# Altium project riego.PrjPcb
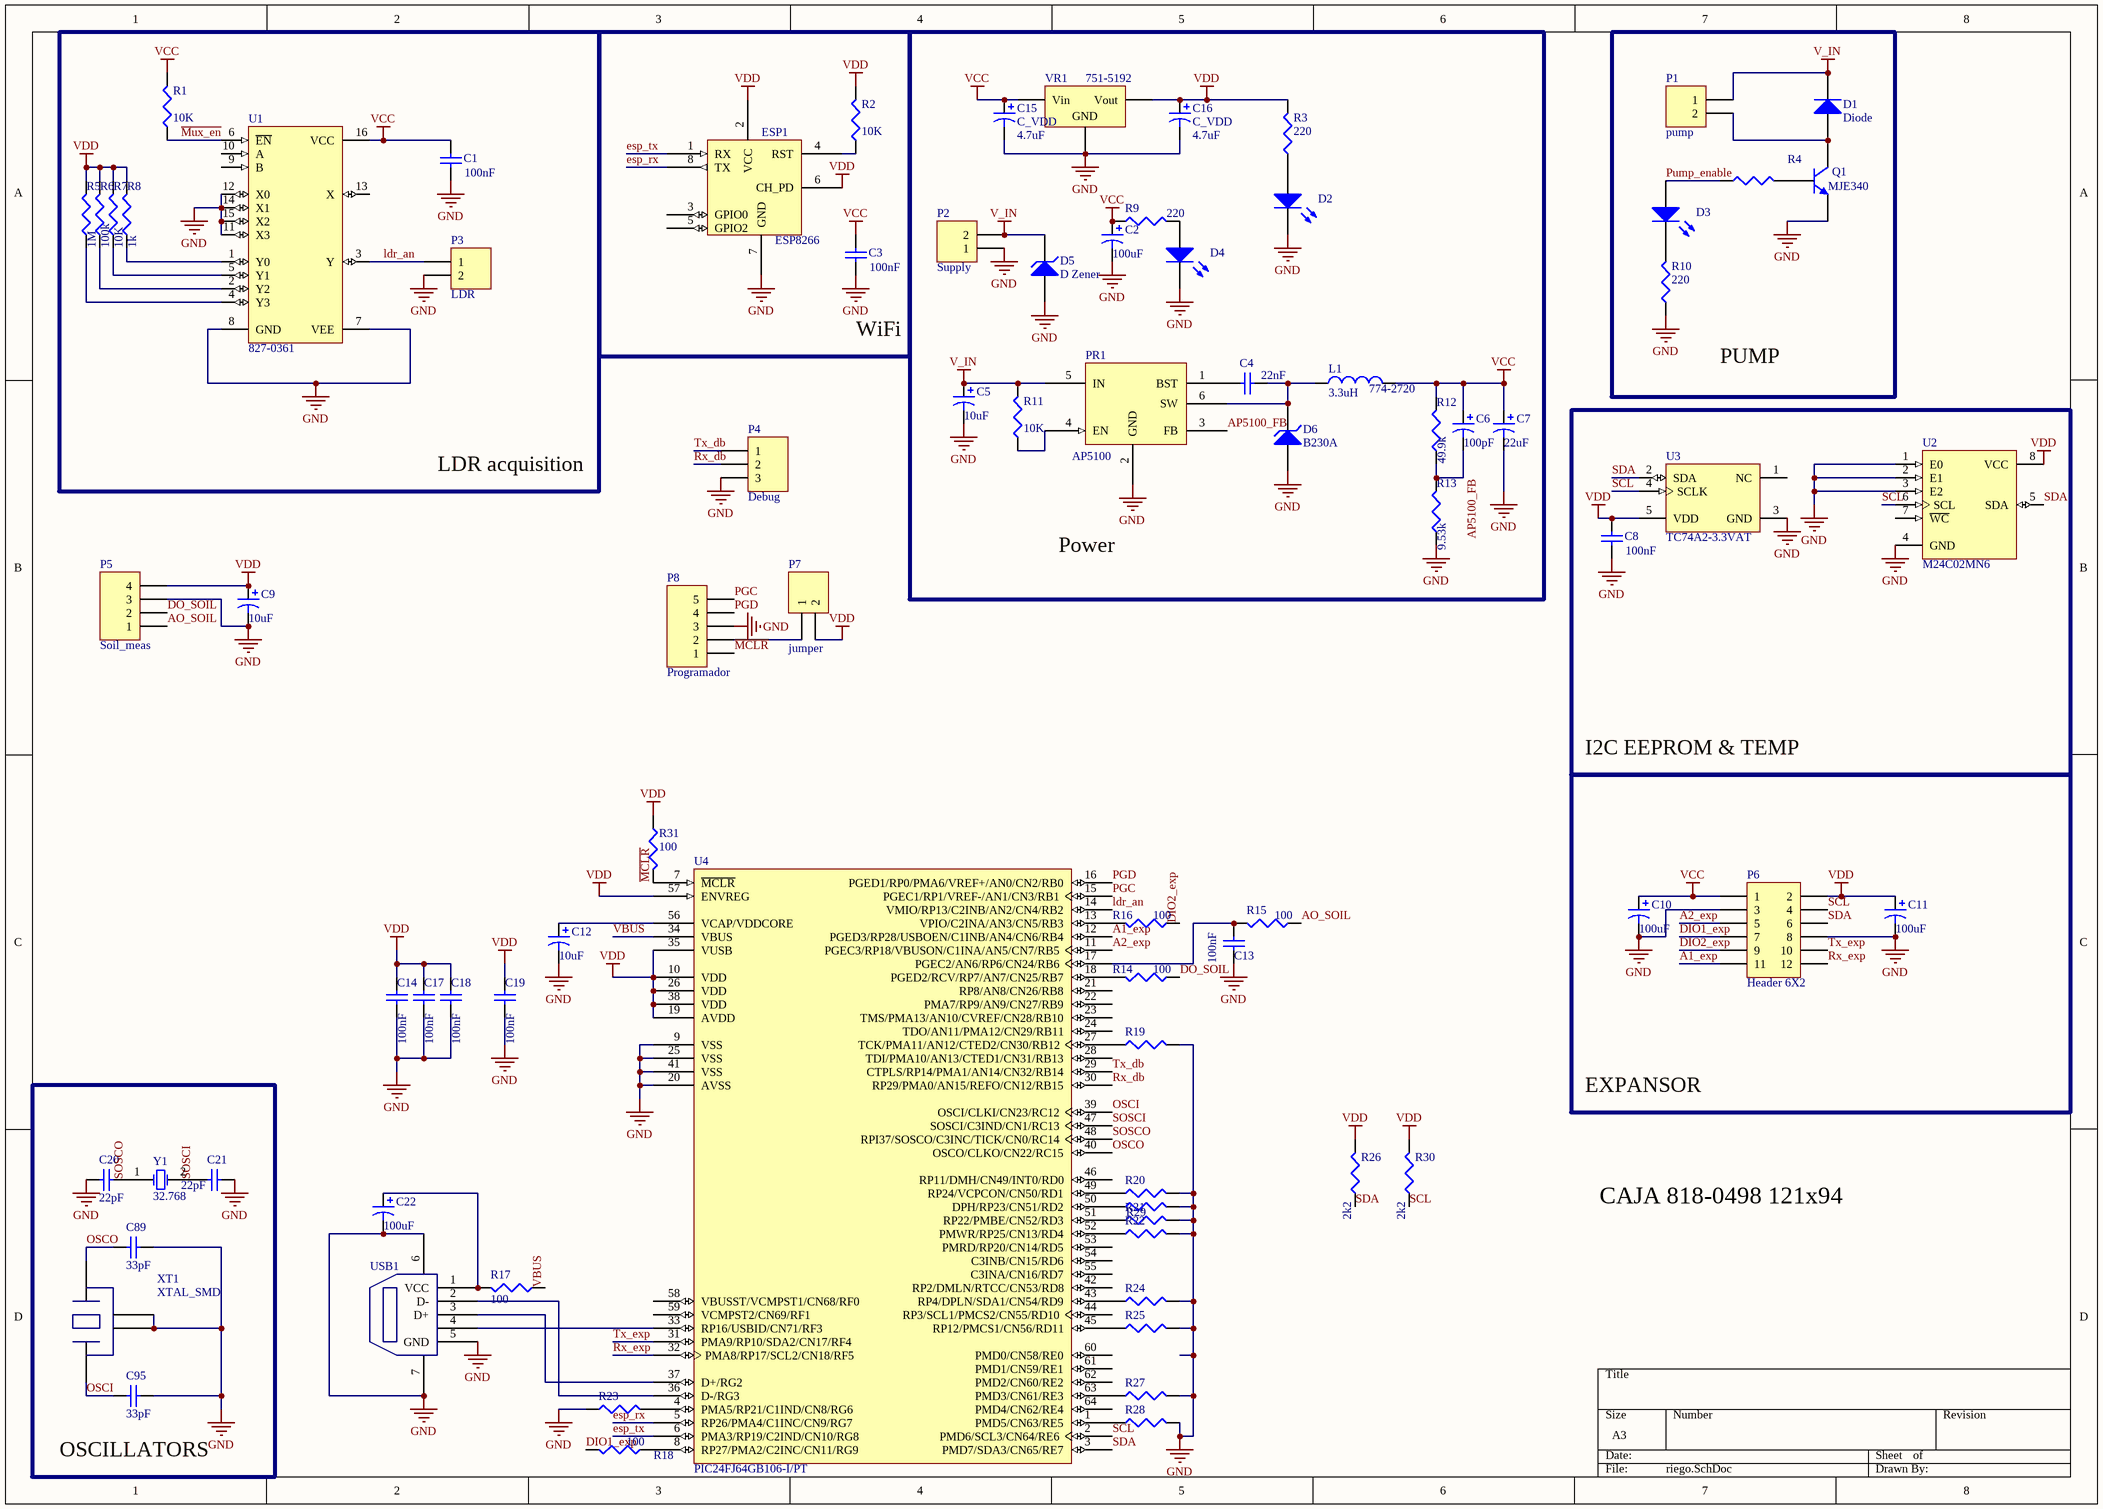
[diagram p0: riego.SchDoc]
1 sheet, 81 parts. Net scope: global (net labels, ports and power ports of the same name join across sheets).
Board file: riego.PcbDoc

## Sheet riego.SchDoc
size A3

### Parts
C1  value 100nF  [CAPC1608L]  (hidden comment: Cap Semi)
C2  value 100uF  [TC3528-1411]
C3  value 100nF  [CAPC1608L]  (hidden comment: Cap Semi)
C4  value 22nF  [CAPC1608L]  (hidden comment: Cap Semi)
C5  value 10uF  [TC3528-1411]
C6  value 100pF  [TC3528-1411]
C7  value 22uF  [TC3528-1411]
C8  value 100nF  [CAPC1608L]  (hidden comment: Cap Semi)
C9  value 10uF  [TC3528-1411]
C10  value 100uF  [TC3528-1411]
C11  value 100uF  [TC3528-1411]
C12  value 10uF  [TC3528-1411]
C13  value 100nF  [CAPC1608L]  (hidden comment: Cap Semi)
C14  value 100nF  [CAPC1608L]  (hidden comment: Cap Semi)
C15  C_VDD  value 4.7uF  [CAPC1608N]
C16  C_VDD  value 4.7uF  [CAPC1608L]
C17  value 100nF  [CAPC1608L]  (hidden comment: Cap Semi)
C18  value 100nF  [CAPC1608L]  (hidden comment: Cap Semi)
C19  value 100nF  [CAPC1608L]  (hidden comment: Cap Semi)
C20  value 22pF  [C1206]  (hidden comment: Cap Semi)
C21  value 22pF  [C1206]  (hidden comment: Cap Semi)
C22  value 100uF  [TC3528-1411]
C89  value 33pF  [C1206]  (hidden comment: Cap Semi)
C95  value 33pF  [C1206]  (hidden comment: Cap Semi)
D1  Diode  [CD4532-1812]
D2  Ledred  [CD1608-0603]  (value not drawn)
D3  Ledred  [CD1608-0603]  (value not drawn)
D4  Ledgreen  [CD1608-0603]  (value not drawn)
D5  D Zener  [CD4532-1812]
D6  B230A  [CD4532-1812]
ESP1  ESP8266  [ESP8266]
L1  774-2720  value 3.3uH  [INDC5750N]
P1  pump  [Headerx2_5.08]
P2  Supply  [JACK_POWER]
P3  LDR  [HDR1X2]
P4  Debug  [HDR1X3]
P5  Soil_meas  [HDR1X4]
P6  Header 6X2  [HEADER_SMD_6x2]
P7  jumper  [HDR1X2]
P8  Programador  [Header_prog]
PR1  AP5100  [SOT26A-6L]
Q1  MJE340  [SOT223-4L]
R1  value 10K  [J1-0603]  (hidden comment: Res3)
R2  value 10K  [J1-0603]  (hidden comment: Res3)
R3  value 220  [J1-0603]  (hidden comment: Res3)
R4  Res3  [J1-0603]  (value not drawn)
R5  value 1M  [J1-0603]  (hidden comment: Res3)
R6  value 100k  [J1-0603]  (hidden comment: Res3)
R7  value 10K  [J1-0603]  (hidden comment: Res3)
R8  value 1k  [J1-0603]  (hidden comment: Res3)
R9  value 220  [J1-0603]  (hidden comment: Res3)
R10  value 220  [J1-0603]  (hidden comment: Res3)
R11  value 10K  [J1-0603]  (hidden comment: Res3)
R12  value 49.9k  [J1-0603]  (hidden comment: Res3)
R13  value 9.53k  [J1-0603]  (hidden comment: Res3)
R14  value 100  [J1-0603]  (hidden comment: Res3)
R15  value 100  [J1-0603]  (hidden comment: Res3)
R16  value 100  [J1-0603]  (hidden comment: Res3)
R17  value 100  [J1-0603]  (hidden comment: Res3)
R18  value 100  [J1-0603]  (hidden comment: Res3)
R19  Res3  [J1-0603]  (value not drawn)
R20  Res3  [J1-0603]  (value not drawn)
R21  Res3  [J1-0603]  (value not drawn)
R22  Res3  [J1-0603]  (value not drawn)
R23  Res3  [J1-0603]  (value not drawn)
R24  Res3  [J1-0603]  (value not drawn)
R25  Res3  [J1-0603]  (value not drawn)
R26  value 2k2  [J1-0603]  (hidden comment: Res3)
R27  Res3  [J1-0603]  (value not drawn)
R28  Res3  [J1-0603]  (value not drawn)
R29  Res3  [J1-0603]  (value not drawn)
R30  value 2k2  [J1-0603]  (hidden comment: Res3)
R31  value 100  [J1-0603]  (hidden comment: Res3)
U1  827-0361  [SO16_L]
U2  M24C02MN6  [SOP8_N]
U3  TC74A2-3.3VAT  [TO-220-AT5]
U4  PIC24FJ64GB106-I/PT  [TQFP-PT64_L]
USB1  Micro_USB  [micro_usb]  (value not drawn)
VR1  751-5192  [DPAK]
XT1  XTAL_SMD  [12SMXB-14SMX]
Y1  32.768  [BCY-W2/D1.5]

### Blocks framed on the sheet
LDR acquisition: C1 P3 R1 R5-R8 U1
WiFi: C3 ESP1 R2
Power: C2 C4-C7 C15 C16 D2 D4-D6 L1 P2 PR1 R3 R9 R11-R13 VR1
PUMP: D1 D3 P1 Q1 R4 R10
I2C EEPROM & TEMP: C8 U2 U3
OSCILLATORS: C20 C21 C89 C95 XT1 Y1

### Nets
GND: C1.1 C2.2 C3.1 C5.2 C7.2 C8.1 C9.2 C10.2 C11.2 C12.2 C13.1 C14.1 C15.2 C16.2 C17.1 C18.1 C19.1 C20.2 C21.1 C22.2 C89.1 C95.1 D2.2(K) D4.2(K) D5.1(A) D6.1(A) ESP1.7(GND) P2.1 P3.2 P4.3 P5.3 P6.3 P6.8 P8.3 PR1.2(GND) Q1.3(E) R10.1 R13.1 R19.2 R20.2 R21.2 R22.2 R23.1 R24.2 R25.2 R27.2 R28.2 R29.2 U1.7(VEE) U1.8(GND) U1.11(X3) U1.12(X0) U1.14(X1) U1.15(X2) U2.1(E0) U2.2(E1) U2.3(E2) U2.4(GND) U3.3(GND) U4.9(VSS) U4.20(AVSS) U4.25(VSS) U4.41(VSS) USB1.5(GND) USB1.6(SH) USB1.7(SH) VR1.2(GND) XT1.2 XT1.4
V_IN: C5.1 D1.2(K) D5.2(K) P1.1 P2.2 PR1.5(IN) R11.2
VCC: C1.2 C2.1 C3.2 C6.1 C7.1 C10.1 C15.1 L1.2 P6.1 R1.2 R9.1 R12.2 U1.16(VCC) VR1.1(Vin)
VDD: C8.2 C9.1 C11.1 C14.2 C16.1 C17.2 C18.2 C19.2 ESP1.2(VCC) ESP1.6(CH_PD) P5.4 P6.2 P7.2 R2.2 R3.2 R5.2 R6.2 R7.2 R8.2 R26.2 R30.2 R31.1 U2.8(VCC) U3.5(VDD) U4.10(VDD) U4.19(AVDD) U4.26(VDD) U4.35(VUSB) U4.38(VDD) U4.57(ENVREG) VR1.3(Vout)
~{MCLR}: P8.1 R31.2 U4.7(~{MCLR})
~{Mux_en}: R1.1 U1.6(~{EN})
A1_exp: P6.11 U4.12(PGED3/RP28/USBOEN/C1INB/AN4/CN6/RB4)
A2_exp: P6.5 U4.11(PGEC3/RP18/VBUSON/C1INA/AN5/CN7/RB5)
AO_SOIL: P5.1 R15.1
AP5100_FB: C6.2 PR1.3(FB) R12.1 R13.2
DIO1_exp: P6.7 R18.2
DIO2_exp: P6.9 R16.1
DO_SOIL: P5.2 R14.1
esp_rx: ESP1.8(TX) U4.5(RP26/PMA4/C1INC/CN9/RG7)
esp_tx: ESP1.1(RX) U4.6(PMA3/RP19/C2IND/CN10/RG8)
ldr_an: P3.1 U1.3(Y) U4.14(VMIO/RP13/C2INB/AN2/CN4/RB2)
OSCI: C95.2 U4.39(OSCI/CLKI/CN23/RC12) XT1.1
OSCO: C89.2 U4.40(OSCO/CLKO/CN22/RC15) XT1.3
PGC: P8.5 U4.15(PGEC1/RP1/VREF-/AN1/CN3/RB1)
PGD: P8.4 U4.16(PGED1/RP0/PMA6/VREF+/AN0/CN2/RB0)
Pump_enable: D3.1(A) R4.1
Rx_db: P4.2 U4.30(RP29/PMA0/AN15/REFO/CN12/RB15)
Rx_exp: P6.12 U4.32(PMA8/RP17/SCL2/CN18/RF5)
SCL: P6.4 R30.1 U2.6(SCL) U3.4(SCLK) U4.2(PMD6/SCL3/CN64/RE6)
SDA: P6.6 R26.1 U2.5(SDA) U3.2(SDA) U4.3(PMD7/SDA3/CN65/RE7)
SOSCI: C21.2 U4.47(SOSCI/C3IND/CN1/RC13) Y1.2(OSC2)
SOSCO: C20.1 U4.48(RPI37/SOSCO/C3INC/TICK/CN0/RC14) Y1.1(OSC1)
Tx_db: P4.1 U4.29(CTPLS/RP14/PMA1/AN14/CN32/RB14)
Tx_exp: P6.10 U4.31(PMA9/RP10/SDA2/CN17/RF4)
VBUS: R17.1 U4.34(VBUS)
NetC4_1: C4.1 D6.2(K) L1.1 PR1.6(SW)
NetC4_2: C4.2 PR1.1(BST)
NetC12_1: C12.1 U4.56(VCAP/VDDCORE)
NetC13_2: C13.2 R15.2 U4.17(PGEC2/AN6/RP6/CN24/RB6)
NetC22_1: C22.1 R17.2 USB1.1(VCC)
NetD1_1: D1.1(A) P1.2 Q1.2(C)
NetD2_1: D2.1(A) R3.1
NetD3_2: D3.2(K) R10.2
NetD4_1: D4.1(A) R9.2
NetESP1_4: ESP1.4(RST) R2.1
NetP7_1: P7.1 P8.2
NetPR1_4: PR1.4(EN) R11.1
NetQ1_1: Q1.1(B) R4.2
NetR5_1: R5.1 U1.4(Y3)
NetR6_1: R6.1 U1.2(Y2)
NetR7_1: R7.1 U1.5(Y1)
NetR8_1: R8.1 U1.1(Y0)
NetR14_2: R14.2 U4.18(PGED2/RCV/RP7/AN7/CN25/RB7)
NetR16_2: R16.2 U4.13(VPIO/C2INA/AN3/CN5/RB3)
NetR18_1: R18.1 U4.8(RP27/PMA2/C2INC/CN11/RG9)
NetR19_1: R19.1 U4.27(TCK/PMA11/AN12/CTED2/CN30/RB12)
NetR20_1: R20.1 U4.49(RP24/VCPCON/CN50/RD1)
NetR21_1: R21.1 U4.51(RP22/PMBE/CN52/RD3)
NetR22_1: R22.1 U4.52(PMWR/RP25/CN13/RD4)
NetR23_2: R23.2 U4.4(PMA5/RP21/C1IND/CN8/RG6)
NetR24_1: R24.1 U4.43(RP4/DPLN/SDA1/CN54/RD9)
NetR25_1: R25.1 U4.45(RP12/PMCS1/CN56/RD11)
NetR27_1: R27.1 U4.63(PMD3/CN61/RE3)
NetR28_1: R28.1 U4.1(PMD5/CN63/RE5)
NetR29_1: R29.1 U4.50(DPH/RP23/CN51/RD2)
NetU4_33: U4.33(RP16/USBID/CN71/RF3) USB1.4
NetU4_36: U4.36(D-/RG3) USB1.2(D-)
NetU4_37: U4.37(D+/RG2) USB1.3(D+)

Not connected (* = marked no-connect by the designer): ESP1 3(GPIO0) 5(GPIO2); U1 9(B) 10(A) 13(X); U2 7(~{WC}); U3 1(NC); U4 21(RP8/AN8/CN26/RB8) 22(PMA7/RP9/AN9/CN27/RB9) 23(TMS/PMA13/AN10/CVREF/CN28/RB10) 24(TDO/AN11/PMA12/CN29/RB11) 28(TDI/PMA10/AN13/CTED1/CN31/RB13) 42(RP2/DMLN/RTCC/CN53/RD8) 44(RP3/SCL1/PMCS2/CN55/RD10) 46(RP11/DMH/CN49/INT0/RD0) 53(PMRD/RP20/CN14/RD5) 54(C3INB/CN15/RD6) 55(C3INA/CN16/RD7) 58(VBUSST/VCMPST1/CN68/RF0) 59(VCMPST2/CN69/RF1) 60(PMD0/CN58/RE0) 61(PMD1/CN59/RE1) 62(PMD2/CN60/RE2) 64(PMD4/CN62/RE4)

### Notes on the sheet
- EXPANSOR
- CAJA 818-0498 121x94

### Library data of the parts
C1 C3 C4 C8 C13 C14 C17-C21 C89 C95 = Cap Semi: Capacitor (Semiconductor SIM Model); Published: 8-Jun-2000; LatestRevisionDate: 17-Jul-2002; LatestRevisionNote: Re-released for DXP Platform.; PackageReference: C1206; Publisher: Altium Limited
C2 C5-C7 C9-C12 C15 C16 C22 = Cap Pol1: Polarized Capacitor (Radial); Published: 8-Jun-2000; LatestRevisionDate: 17-Jul-2002; LatestRevisionNote: Re-released for DXP Platform.; PackageReference: RB7.6-15; Publisher: Altium Limited
D1 = Diode: Default Diode; Published: 8-Jun-2000; LatestRevisionDate: 17-Jul-2002; LatestRevisionNote: Re-released for DXP Platform.; PackageDocument: Sep-1996; PackageReference: SMC; Publisher: Altium Limited; Code_JEDEC: DO-214-AB
D2-D4 = LED3: Typical BLUE SiC LED; Published: 8-Jun-2000; LatestRevisionDate: 17-Dec-2003; LatestRevisionNote: PCB Footprint replaced.; DatasheetDocument: 16-Apr-2002; PackageDocument: 16-Apr-2002; PackageReference: 3.5X2.8X1.9; Publisher: Altium Limited
D5 D6 = D Zener: Zener Diode; Published: 8-Jun-2000; LatestRevisionDate: 17-Jul-2002; LatestRevisionNote: Re-released for DXP Platform.; PackageReference: DIODE-0.7; Publisher: Altium Limited
L1 = Inductor: Code_IEC: 1005; Published: 8-Jun-2000; LatestRevisionDate: 17-Jul-2002; LatestRevisionNote: Re-released for DXP Platform.; PackageReference: 0402-A; Publisher: Altium Limited; Code_JEITA: 0402
P1-P3 P7 = Header 2: Header, 2-Pin; LatestRevisionDate: 17-Jul-2002; LatestRevisionNote: Re-released for DXP Platform.; Publisher: Altium Limited
P4 = Header 3: Header, 3-Pin; LatestRevisionDate: 17-Jul-2002; LatestRevisionNote: Re-released for DXP Platform.; Publisher: Altium Limited
P5 = Header 4: Header, 4-Pin; LatestRevisionDate: 17-Jul-2002; LatestRevisionNote: Re-released for DXP Platform.; Publisher: Altium Limited
P6 = Header 6X2: Header, 6-Pin, Dual row; LatestRevisionDate: 17-Jul-2002; LatestRevisionNote: Re-released for DXP Platform.; Publisher: Altium Limited
P8 = Header 5: Header, 5-Pin; LatestRevisionDate: 17-Jul-2002; LatestRevisionNote: Re-released for DXP Platform.; Publisher: Altium Limited
PR1 = AP5100: Step down converter (751-3005)
Q1 = MJE340: Complementary Silicon Power Transistor; Published: 8-Jun-2000; LatestRevisionDate: 11-Dec-2002; LatestRevisionNote: Sim Port Map correction; DatasheetVersion: Jun-1997; PackageVersion: Oct-1997; PackageReference: SOT32; Publisher: Altium Limited; PackageDescription: SIP with Mounting Hole; 3 Leads; Body 10.7 x 7.6 x 2.6 mm (typ); Pitch 2.2 mm; ComponentLink1Description: Manufacturer Link; ComponentLink1URL: http://www.st.com/; ComponentLink2Description: Datasheet; ComponentLink2URL: http://www.st.com/stonline/products/literature/ds/4171/mje340.pdf
R1-R3 R5-R18 R26 R30 R31 = Res3: Resistor; Published: 8-Jun-2000; LatestRevisionDate: 04-Mar-2005; LatestRevisionNote: PCB Footprint replaced.; PackageReference: J1-0603; Publisher: Altium Limited
R4 R19-R25 R27-R29 = Res3: Resistor; Value: 220; Published: 8-Jun-2000; LatestRevisionDate: 04-Mar-2005; LatestRevisionNote: PCB Footprint replaced.; PackageReference: J1-0603; Publisher: Altium Limited
U1 = M74HC4052M1R: Analog Multiplexer/Demultiplexer Dual 4-Channel; Published: 8-Jun-2000; LatestRevisionDate: 13-Apr-2006; LatestRevisionNote: IPC-7351 Footprint Added.; DatasheetVersion: Oct-1993; PackageVersion: May-1998; PackageReference: SO16; Publisher: Altium Limited; PackageDescription: 16-Pin Small Outline Integrated Circuit 1.27 mm Pitch; Code_IPC: SOIC127P600-16; ComponentLink1Description: Manufacturer Link; ComponentLink1URL: http://www.st.com/; ComponentLink2Description: Datasheet; ComponentLink2URL: http://www.st.com/stonline/products/literature/ds/7730/m74hc4052.pdf
U2 = M24C02MN6: 2Kbit Serial I²C Bus EEPROM; Published: 24-Aug-2001; LatestRevisionDate: 13-Apr-2006; LatestRevisionNote: IPC-7351 Footprint Added.; DatasheetVersion: Sep-1999; PackageVersion: Jul-1999; PackageReference: SOP8; Publisher: Altium Limited; PackageDescription: 8-Pin Small Outline Integrated Circuit 1.27 mm Pitch; ComponentLink1Description: Manufacturer Link; ComponentLink1URL: http://www.st.com/; ComponentLink2Description: Datasheet; ComponentLink2URL: http://www.st.com/stonline/products/literature/ds/5067/m24c01-r.pdf
U3 = TC74A2-3.3VAT: Tiny Serial Digital Thermal Sensor, 5-Pin TO-220, Extended Temperature; Published: 29-Jan-2009; DatasheetVersion: 18-Oct-02; PackageVersion: revAW, Oct-2008; PackageReference: TO-220-AT5; Publisher: Altium Limited; ComponentLink1Description: Manufacturer Link; ComponentLink1URL: http://www.microchip.com; ComponentLink2Description: Datasheet; ComponentLink2URL: http://ww1.microchip.com/downloads/en/DeviceDoc/21462c.pdf; ComponentLink3Description: Packaging Specification; ComponentLink3URL: http://ww1.microchip.com/downloads/en/PackagingSpec/00049AW.pdf
U4 = PIC24FJ64GB106-I/PT: General Purpose 16-Bit Flash Microcontroller with USB On-The-Go, 64KB Flash, 16KB SRAM, 64-Pin TQFP, Industrial Temperature; Published: 29-Jan-2009; DatasheetVersion: Rev B, Mar-2008; PackageVersion: revAW, Oct-2008; PackageReference: TQFP-PT64; Publisher: Altium Limited; PackageDescription: 64-Lead Thin Plastic Quad Flat Pack (PT) - 10x10x1mm Body, 2.00mm [TQFP]; Code_JEDEC: MS-026; ComponentLink1Description: Manufacturer Link; ComponentLink1URL: http://www.microchip.com; ComponentLink2Description: Datasheet; ComponentLink2URL: http://ww1.microchip.com/downloads/en/DeviceDoc/39897b.pdf; ComponentLink3Description: Packaging Specification; ComponentLink3URL: http://ww1.microchip.com/downloads/en/PackagingSpec/00049AW.pdf
VR1 = Volt Reg: Voltage Regulator; Published: 24-Mar-1999; LatestRevisionDate: 17-Jul-2002; LatestRevisionNote: Re-released for DXP Platform.; PackageReference: D2PAK; Publisher: Altium Limited; Code_JEDEC: SMD-220
Y1 = XTAL: Crystal Oscillator; Published: 8-Jun-2000; LatestRevisionDate: 17-Jul-2002; LatestRevisionNote: Re-released for DXP Platform.; PackageReference: R38; Publisher: Altium Limited